# EAGLE schematic pendrive (EAGLE 6.4)
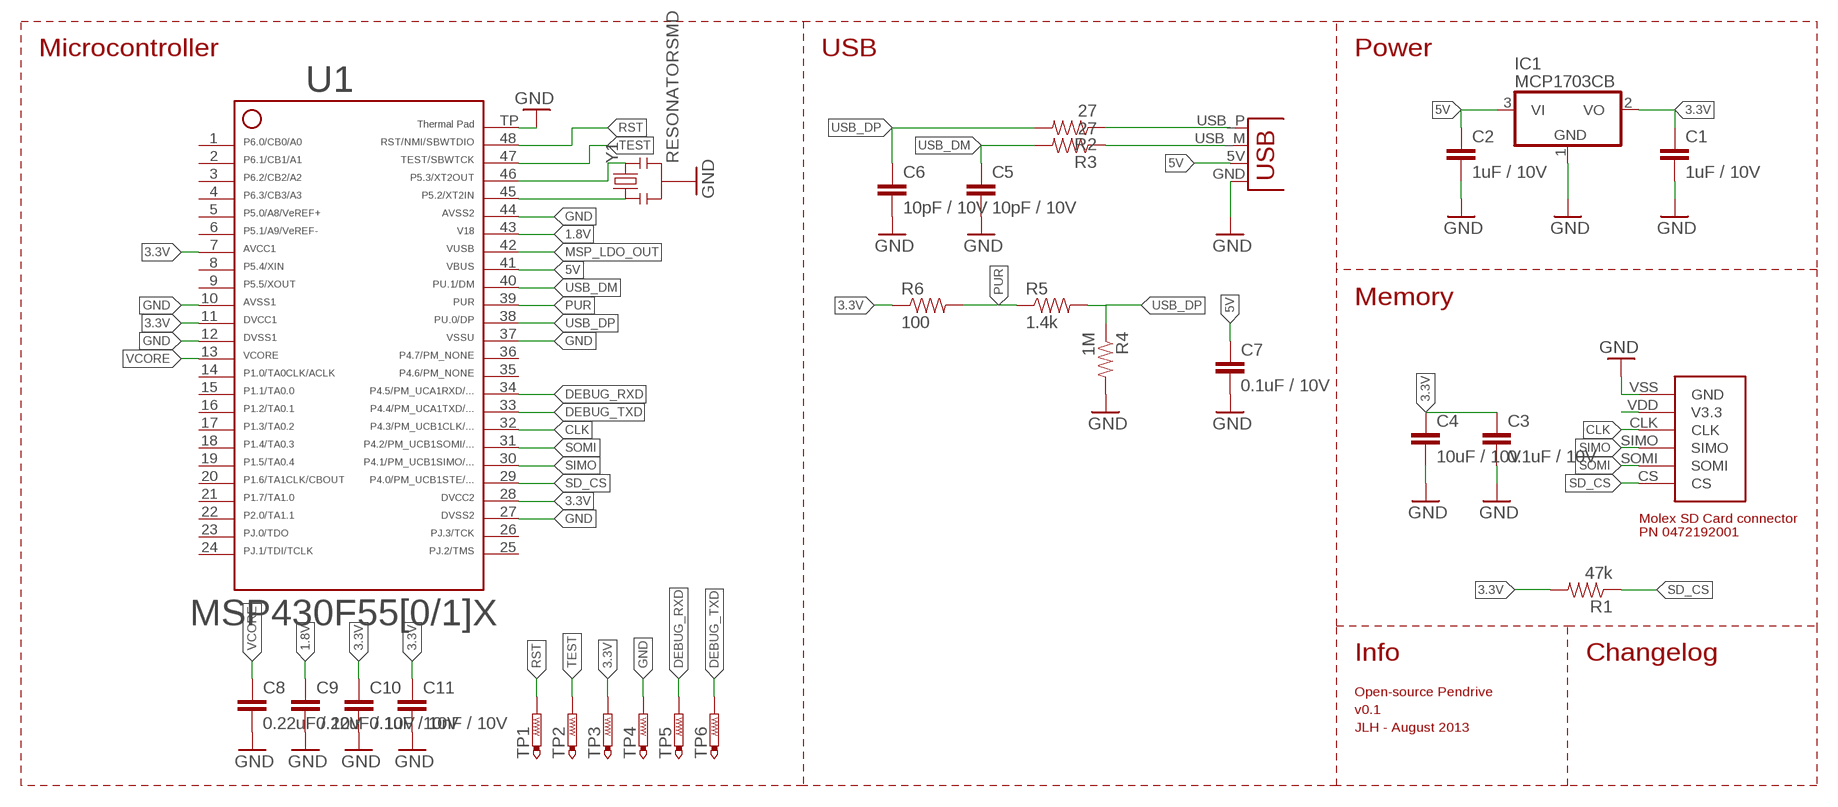
[diagram p0: schematic, sheet 1]

## Parts
C1  1uF / 10V  CAP0402-CAP  [0402-CAP]
C2  1uF / 10V  CAP0402-CAP  [0402-CAP]
C3  0.1uF / 10V  CAP0402-CAP  [0402-CAP]
C4  10uF / 10V  CAP1206  [1206]
C5  10pF / 10V  CAP0402-CAP  [0402-CAP]
C6  10pF / 10V  CAP0402-CAP  [0402-CAP]
C7  0.1uF / 10V  CAP0402-CAP  [0402-CAP]
C8  0.22uF / 10V  CAP0402-CAP  [0402-CAP]
C9  0.22uF / 10V  CAP0402-CAP  [0402-CAP]
C10  0.1uF / 10V  CAP0402-CAP  [0402-CAP]
C11  10nF / 10V  CAP0402-CAP  [0402-CAP]
IC1  MCP1703CB  [SOT23]
R1  47k  RESISTOR0402-RES  [0402-RES]
R2  27  RESISTOR0402-RES  [0402-RES]
R3  27  RESISTOR0402-RES  [0402-RES]
R4  1M  RESISTOR0402-RES  [0402-RES]
R5  1.4k  RESISTOR0402-RES  [0402-RES]
R6  100  RESISTOR0402-RES  [0402-RES]
TP1  PTR1TP10SQ  [TP10SQ]
TP2  PTR1TP10SQ  [TP10SQ]
TP3  PTR1TP10SQ  [TP10SQ]
TP4  PTR1TP10SQ  [TP10SQ]
TP5  PTR1TP10SQ  [TP10SQ]
TP6  PTR1TP10SQ  [TP10SQ]
U1  F55[0/1]X---RGZ48  [RGZ48]
U2  MICROSD-MOLEX  [MICROSD-MOLEX]
X1  USBPCB  [USB-A-PCB]
Y1  RESONATORSMD  [RESONATOR-SMD]

## Nets
1.8V: C9.1 U1.43
3.3V: C1.1 C3.1 C4.1 C10.1 C11.1 IC1.2(VO) R1.2 R6.1 TP3.TP U1.7 U1.11 U1.28 U2.VDD(V3.3)
5V: C2.1 C7.1 IC1.3(VI) U1.41 X1.5V(VBUS)
CLK: U1.32 U2.CLK
DEBUG_RXD: TP5.TP U1.34
DEBUG_TXD: TP6.TP U1.33
GND: C1.2 C2.2 C3.2 C4.2 C5.2 C6.2 C7.2 C8.2 C9.2 C10.2 C11.2 IC1.1(GND) R4.2 TP4.TP U1.10 U1.12 U1.27 U1.37 U1.44 U1.TP U2.VSS(GND) X1.GND Y1.2
MSP_LDO_OUT: U1.42
N$1: R2.1 X1.USB_P(D+)
N$2: R3.1 X1.USB_M(D-)
N$4: U1.45 Y1.1
N$5: U1.46 Y1.3
PUR: R5.1 R6.2 U1.39
RST: TP1.TP U1.48
SD_CS: R1.1 U1.29 U2.CS
SIMO: U1.30 U2.SIMO
SOMI: U1.31 U2.SOMI
TEST: TP2.TP U1.47
USB_DM: C5.1 R3.2 U1.40
USB_DP: C6.1 R2.2 R4.1 R5.2 U1.38
VCORE: C8.1 U1.13
Unconnected: U1.1 U1.2 U1.3 U1.4 U1.5 U1.6 U1.8 U1.9 U1.14 U1.15 U1.16 U1.17 U1.18 U1.19 U1.20 U1.21 U1.22 U1.23 U1.24 U1.25 U1.26 U1.35 U1.36

## Notes on the sheet
- Microcontroller | USB | Power
- Memory
- Molex SD Card connector
  PN 0472192001
- Info | Changelog
- Open-source Pendrive
- v0.1
- JLH - August 2013

## Library data of the parts
C1-C11 = SparkFun:CAP: Capacitor Standard 0603 ceramic capacitor, and 0.1" leaded capacitor.
IC1 = linear:MCP1703: 250 mA, 16V, Low Quiescent Current LDO Regulator Source: http://ww1.microchip.com/downloads/en/DeviceDoc/22049b.pdf
R1-R6 = SparkFun:RESISTOR: Resistor Basic schematic elements and footprints for 0603, 1206, and PTH resistors.
TP1-TP6 = testpad:PTR1: TEST PIN
U1 = TI_MSP430_v16:F55[0/1]X---RGZ48: ***F55[0/1/2]X*** RGZ48 Rev. 1.0 06/2010 "http://www.ti.com/lit/gpn/msp430f5509"
U2 = Satelinx:MICROSD-MOLEX: SD Card connector from Molex PN 0472192001
X1 = SparkFun:USB: USB Connectors USB-B-PTH is fully proven SKU : PRT-00139 USB-miniB is fully proven SKU : PRT-00587 USB-A-PCB is untested. USB-A-H is throughly reviewed, but untested. Spark Fun Electronics SKU : PRT-00437 USB-B-SMT is throughly reviewed, but untested. Needs silkscreen touching up. USB-A-S has not been used/tested USB-MB-H has not been used/tested
Y1 = SparkFun:RESONATOR: Resonator Small SMD resonator. This is the itty bitty 10/20MHz resonators with built in caps. CSTCE10M0G55 and CSTCE20M0V53. Footprint has been reviewed closely but hasn't been tested yet.